# EAGLE design SineGenerator (EAGLE 6.4)
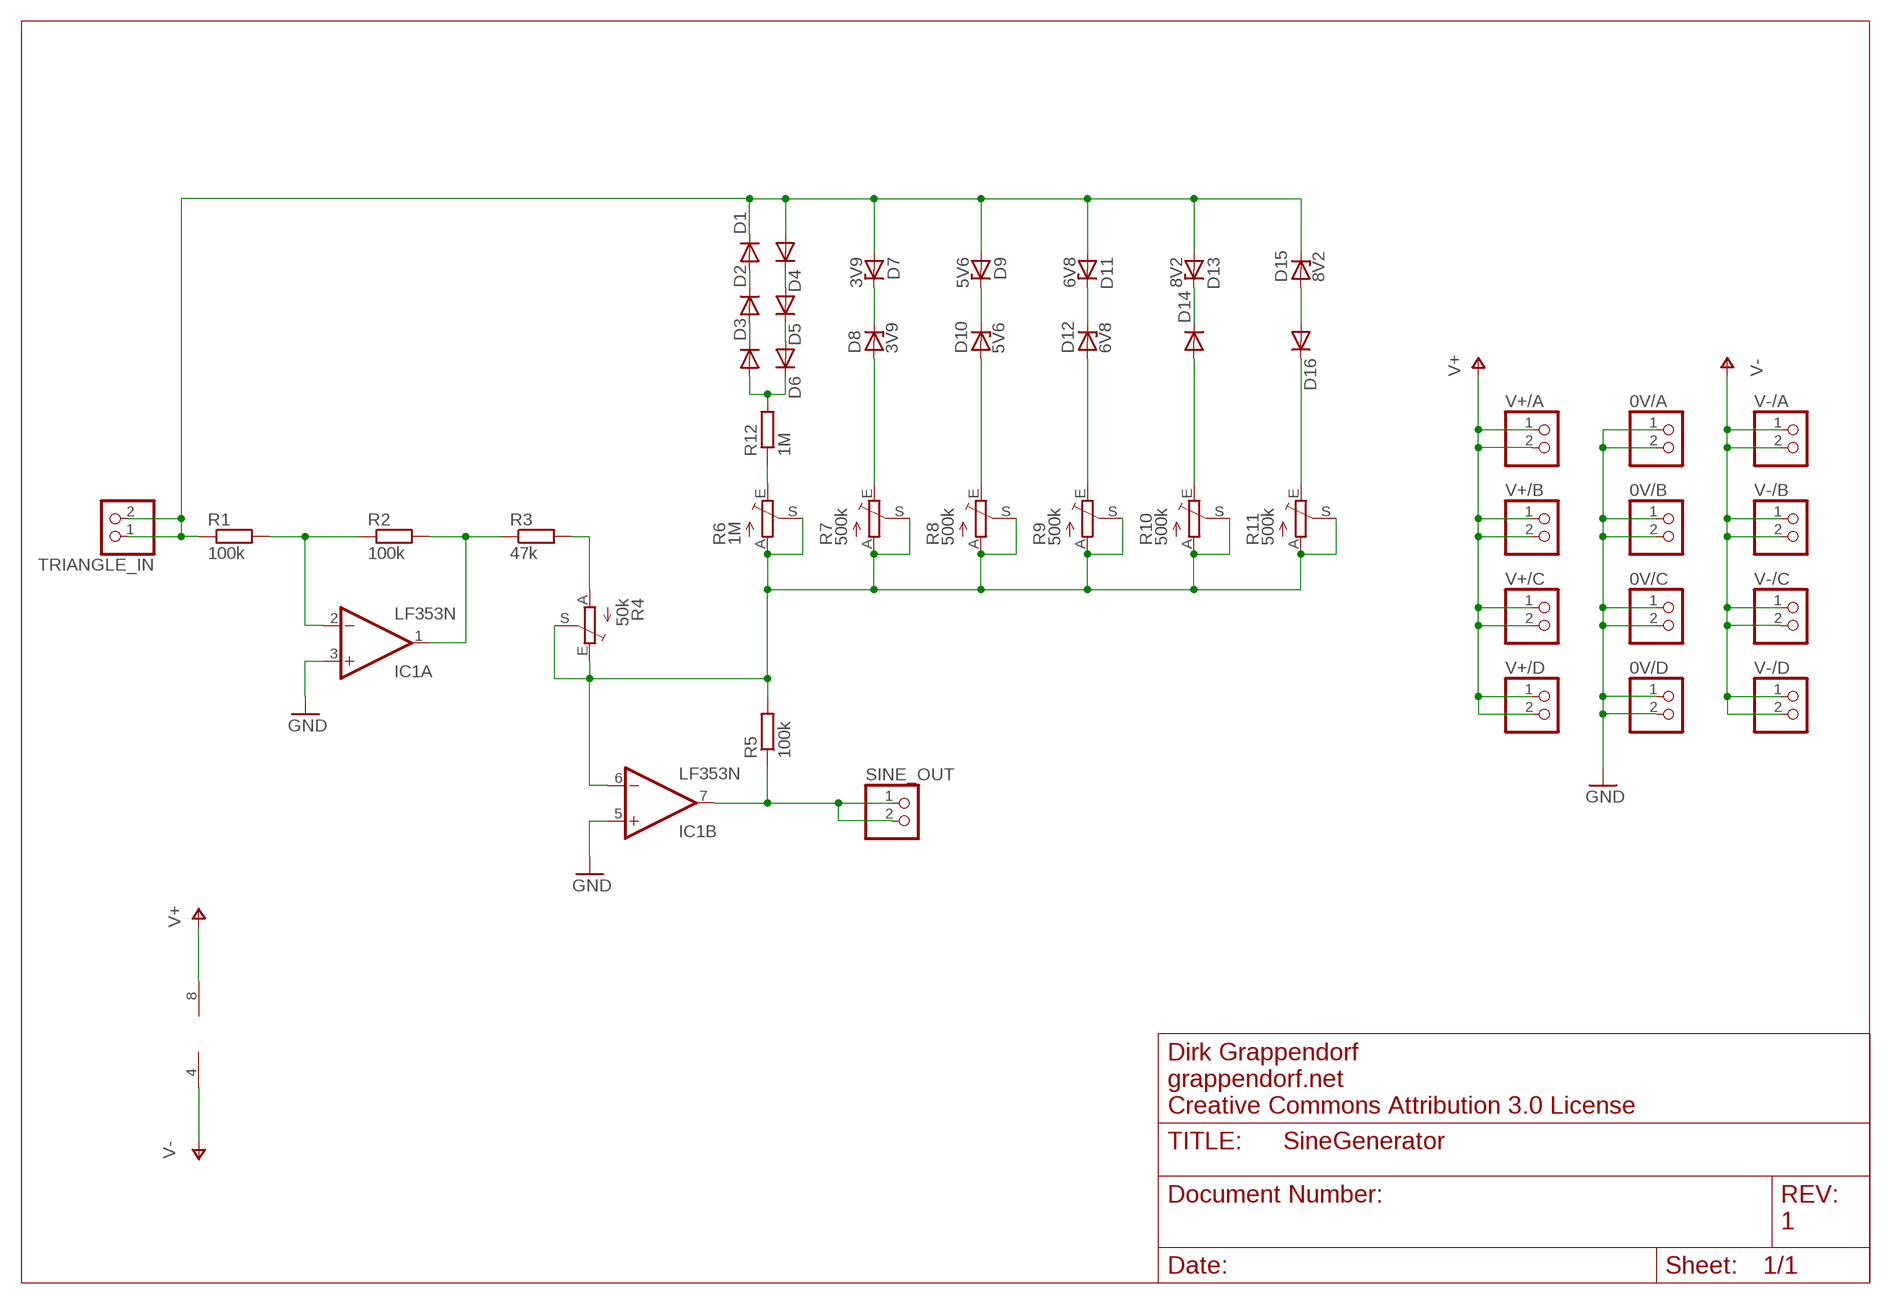
[diagram p0: schematic, sheet 1]

## Parts
0V/A  PINHD-1X2  [1X02]
0V/B  PINHD-1X2  [1X02]
0V/C  PINHD-1X2  [1X02]
0V/D  PINHD-1X2  [1X02]
D1  DIODE1N4148  [DIODE-1N4148]
D2  DIODE1N4148  [DIODE-1N4148]
D3  DIODE1N4148  [DIODE-1N4148]
D4  DIODE1N4148  [DIODE-1N4148]
D5  DIODE1N4148  [DIODE-1N4148]
D6  DIODE1N4148  [DIODE-1N4148]
D7  3V9  ZENER-DIODEDO34-7  [DO34Z7]
D8  3V9  ZENER-DIODEDO34-7  [DO34Z7]
D9  5V6  ZENER-DIODEDO34-7  [DO34Z7]
D10  5V6  ZENER-DIODEDO34-7  [DO34Z7]
D11  6V8  ZENER-DIODEDO34-7  [DO34Z7]
D12  6V8  ZENER-DIODEDO34-7  [DO34Z7]
D13  8V2  ZENER-DIODEDO34-7  [DO34Z7]
D14  DIODE1N4148  [DIODE-1N4148]
D15  8V2  ZENER-DIODEDO34-7  [DO34Z7]
D16  DIODE1N4148  [DIODE-1N4148]
IC1  LF353N  [DIL08]
R1  100k  R-EU_0207/7  [0207/7]
R2  100k  R-EU_0207/7  [0207/7]
R3  47k  R-EU_0207/7  [0207/7]
R4  50k  TRIM_EU-LI15  [LI15]
R5  100k  R-EU_0207/7  [0207/7]
R6  1M  TRIM_EU-ST15  [ST15]
R7  500k  TRIM_EU-ST15  [ST15]
R8  500k  TRIM_EU-ST15  [ST15]
R9  500k  TRIM_EU-ST15  [ST15]
R10  500k  TRIM_EU-ST15  [ST15]
R11  500k  TRIM_EU-ST15  [ST15]
R12  1M  R-EU_0207/7  [0207/7]
SINE_OUT  PINHD-1X2  [1X02]
TRIANGLE_IN  PINHD-1X2  [1X02]
V+/A  PINHD-1X2  [1X02]
V+/B  PINHD-1X2  [1X02]
V+/C  PINHD-1X2  [1X02]
V+/D  PINHD-1X2  [1X02]
V-/A  PINHD-1X2  [1X02]
V-/B  PINHD-1X2  [1X02]
V-/C  PINHD-1X2  [1X02]
V-/D  PINHD-1X2  [1X02]

## Nets
GND: 0V/A.1 0V/A.2 0V/B.1 0V/B.2 0V/C.1 0V/C.2 0V/D.1 0V/D.2 IC1.3(A:+IN) IC1.5(B:+IN)
N$1: IC1.2(A:-IN) R1.2 R2.1
N$2: D9.C D10.C
N$3: IC1.1(A:OUT) R2.2 R3.1
N$4: D10.A R8.E
N$6: R3.2 R4.A
N$7: D11.C D12.C
N$8: IC1.6(B:-IN) R4.E R4.S R5.2 R6.A R6.S R7.A R7.S R8.A R8.S R9.A R9.S R10.A R10.S R11.A R11.S
N$10: IC1.7(B:OUT) R5.1 SINE_OUT.1 SINE_OUT.2
N$16: D1.C D4.A D7.A D9.A D11.A D13.A D15.C R1.1 TRIANGLE_IN.1 TRIANGLE_IN.2
N$17: D1.A D2.C
N$18: D2.A D3.C
N$19: D3.A D6.C R12.2
N$20: D5.C D6.A
N$21: D4.C D5.A
N$22: R6.E R12.1
N$23: D7.C D8.C
N$24: D8.A R7.E
N$25: D12.A R9.E
N$26: D13.C D14.C
N$27: D14.A R10.E
N$28: D15.A D16.A
N$29: D16.C R11.E
V+: IC1.8(P:V+) V+/A.1 V+/A.2 V+/B.1 V+/B.2 V+/C.1 V+/C.2 V+/D.1 V+/D.2
V-: IC1.4(P:V-) V-/A.1 V-/A.2 V-/B.1 V-/B.2 V-/C.1 V-/C.2 V-/D.1 V-/D.2

## Notes on the sheet
- Dirk Grappendorf
- grappendorf.net
- Creative Commons Attribution 3.0 License
- 1

## Library data of the parts
0V/A 0V/B 0V/C 0V/D SINE_OUT TRIANGLE_IN V+/A V+/B V+/C V+/D V-/A V-/B V-/C V-/D = pinhead:PINHD-1X2: PIN HEADER
D1-D6 D14 D16 = SparkFun:DIODE: Diode These are standard reverse protection diodes and small signal diodes. SMA package can handle up to about 1A. SOD-323 can handle about 200mA. What the SOD-323 package when ordering, there are some mfgs out there that are 5-pin packages.
D7-D13 D15 = diode:ZENER-DIODE: Z-Diode
IC1 = linear:LF353: OP AMP
R1-R3 R5 R12 = rcl:R-EU_: RESISTOR, European symbol
R4 R6-R11 = pot:TRIM_EU-: POTENTIOMETER

## Board
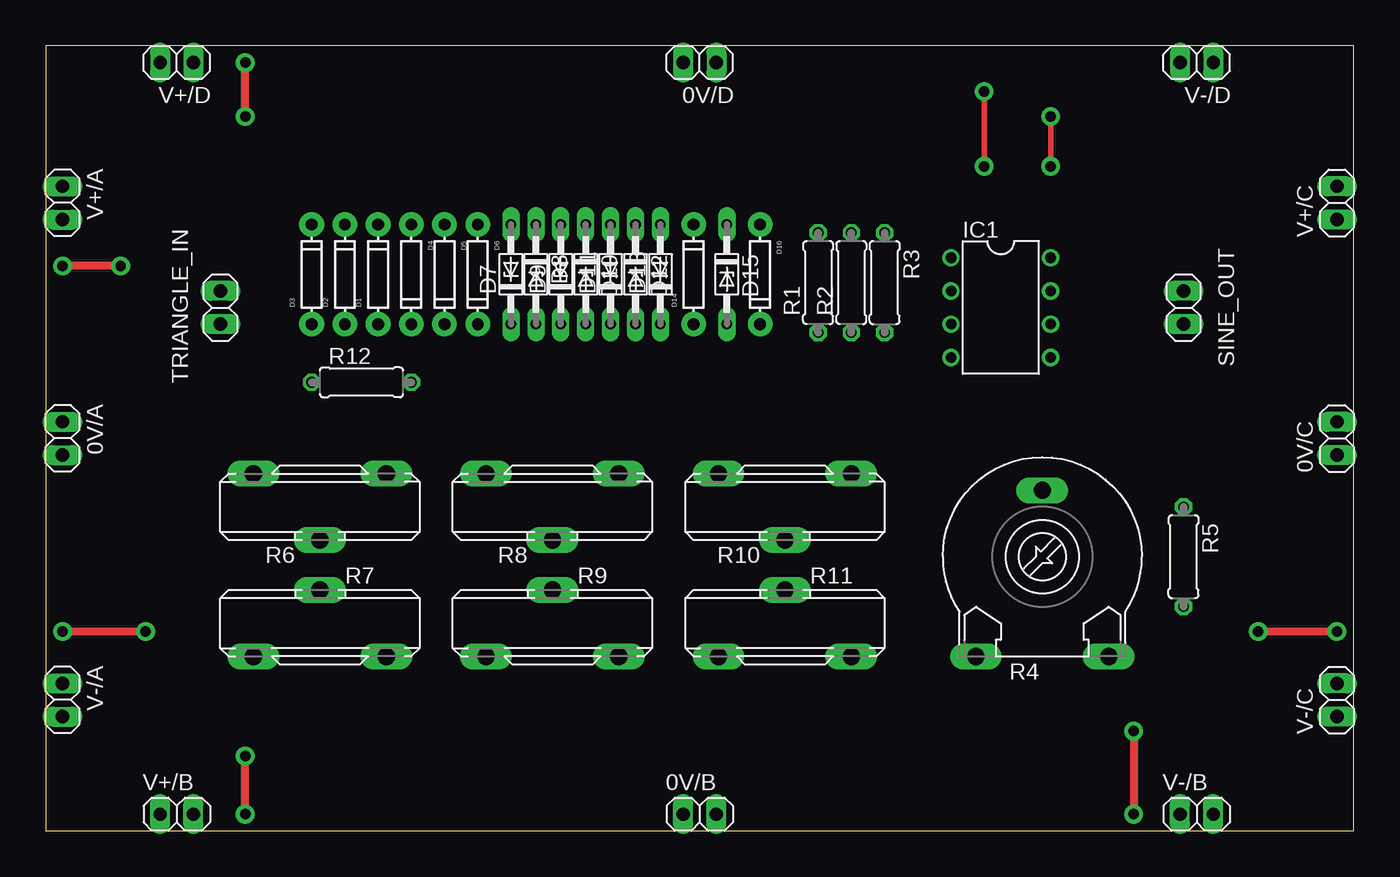
[diagram p1: board, top side]
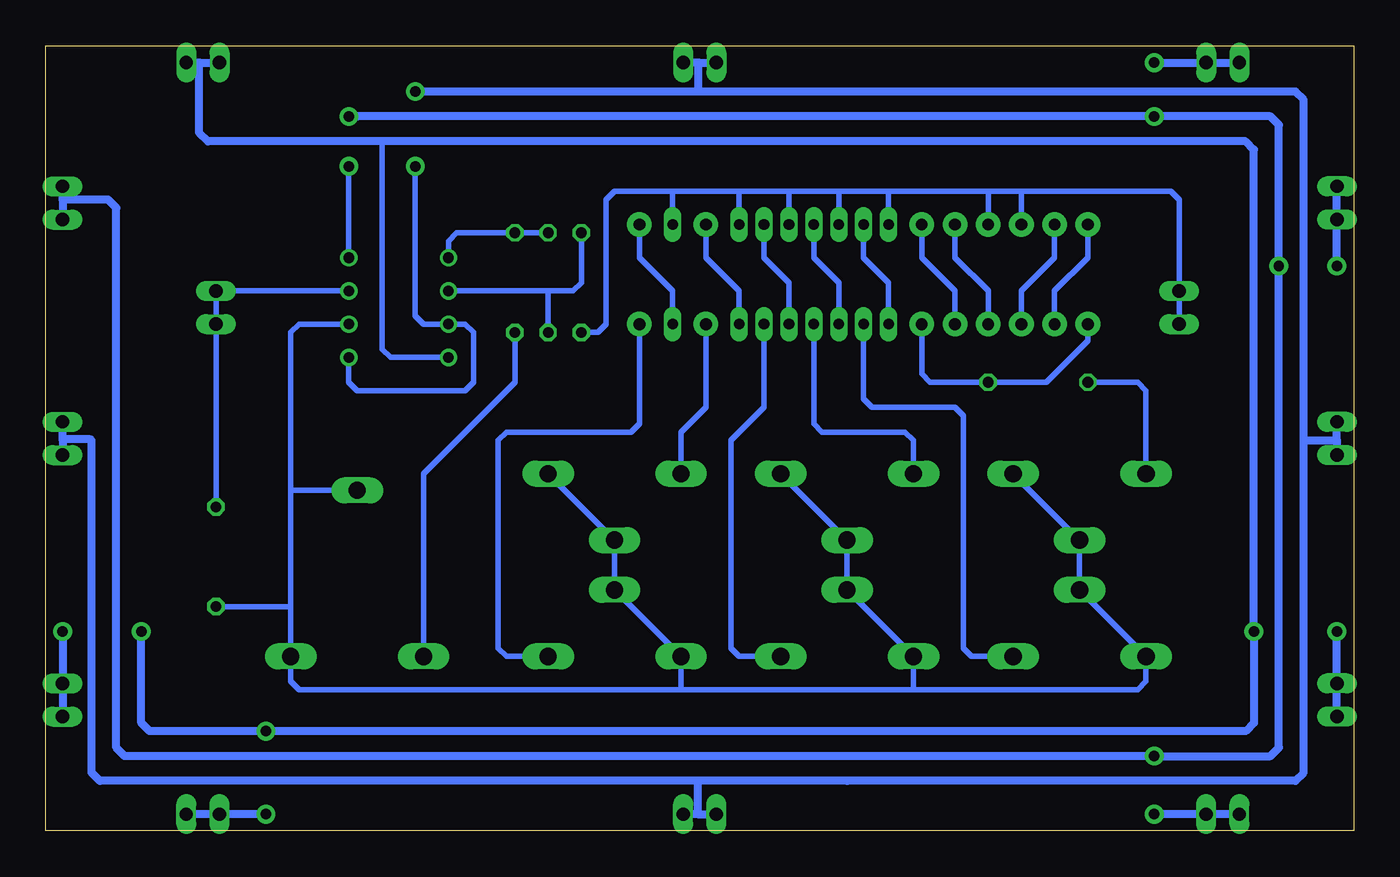
[diagram p2: board, bottom side, seen from below]

Size 100 x 60 mm. Coordinates in mm from the lower left corner, seen from the top.
Outline: 0,0 100,0 100,60 0,60 0,0
Copper layers (1*16): Top 0.035mm / dielectric 1.5mm / Bottom 0.035mm
Design rules "default *": minimum track width 10mil, minimum drill 24mil, track to track 8mil, track to pad 8mil, pad to pad 8mil, via to via 8mil, smd to smd 8mil, copper to edge 40mil, drill to drill 8mil, minimum pad ring 10mil, minimum via ring 8mil, stop-mask expansion 4mil, vias tented up to drill 0mil, thermal gap 10mil

### Footprints (pad centres in the part's own frame; a part is rotated, then mirrored left to right if it is on the bottom)
1X02 = drill 1.016 long: 1 -1.27,0; 2 1.27,0
DIODE-1N4148 = drill 0.9 pad 1.88: A -3.81,0; C 3.81,0
DO34Z7 = drill 0.813 long: A 3.81,0; C -3.81,0
DIL08 = drill 0.813 pad 1.27: 1 -3.81,-3.81; 2 -1.27,-3.81; 3 1.27,-3.81; 4 3.81,-3.81; 5 3.81,3.81; 6 1.27,3.81; 7 -1.27,3.81; 8 -3.81,3.81
0207/7 = drill 0.813 octagon: 1 -3.81,0; 2 3.81,0
LI15 = drill 1.321 long: A -5.08,-7.62; E 5.08,-7.62; S 0,5.08
ST15 = drill 1.321 long: A -5.08,-2.54; E 5.08,-2.54; S 0,2.54

### Placement (x,y rotation side)
0V/A  1.27,30 270 top
0V/B  50,1.27 0 top
0V/C  98.73,30 90 top
0V/D  50,58.73 180 top
D1  25.4,42.55 90 top
D2  22.86,42.55 90 top
D3  20.32,42.55 90 top
D4  27.94,42.55 270 top
D5  30.48,42.55 270 top
D6  33.02,42.55 270 top
D7  35.56,42.55 90 top
D8  37.47,42.55 270 top
D9  39.37,42.55 90 top
D10  41.27,42.55 270 top
D11  43.18,42.55 90 top
D12  45.09,42.55 270 top
D13  46.99,42.55 90 top
D14  49.53,42.55 90 top
D15  52.07,42.55 270 top
D16  54.61,42.55 270 top
IC1  73.03,40.01 270 top
R1  59.05,41.91 90 top
R2  61.59,41.91 90 top
R3  64.14,41.91 270 top
R4  76.2,20.95 0 top
R5  87,20.95 270 top
R6  20.95,24.77 180 top
R7  20.95,15.88 0 top
R8  38.73,24.77 180 top
R9  38.73,15.88 0 top
R10  56.52,24.77 180 top
R11  56.52,15.88 0 top
R12  24.13,34.29 0 top
SINE_OUT  87,40.01 90 top
TRIANGLE_IN  13.34,40.01 90 top
V+/A  1.27,48 270 top
V+/B  10,1.27 0 top
V+/C  98.73,48 90 top
V+/D  10,58.73 180 top
V-/A  1.27,10 270 top
V-/B  88,1.27 0 top
V-/C  98.73,10 90 top
V-/D  88,58.73 180 top

### Tracks (layer width: path | path; a pad name or v marks a point on that pad's centre or on a via)
GND  (via drill 0.8)
  Top 0.406: v71.75,56.52 v71.75,50.8
  Bottom 0.406: IC1.5 76.83,34.29 76.2,33.66 67.94,33.66 67.31,34.29 67.31,38.1 67.94,38.73 IC1.3 71.12,38.73 71.75,39.37 v71.75,50.8 | 71.12,56.52 v71.75,56.52
  Bottom 0.61: 1.27,29.84 0V/A.2 | 1.27,29.84 0V/A.1 | 50.08,58.73 0V/D.2 | 50.08,58.73 0V/D.1 | 98.73,29.93 0V/C.1 98.48,28.48 | 98.73,29.93 0V/C.2 | 50.16,1.27 0V/B.1 | 50.16,1.27 0V/B.2 | 3.81,29.84 3.81,5.08 3.81,4.45 4.45,3.81 38.73,3.81 50.16,3.81 | 3.81,29.84 3.81,55.88 4.45,56.52 50.16,56.52 | 50.16,3.81 95.89,3.81 96.52,4.45 96.52,29.84 96.6,29.93 98.73,29.93 | 50.16,56.52 71.12,56.52 v71.75,56.52 | 3.81,29.84 1.27,29.84 | 50.16,3.81 50.16,1.27 | 50.08,58.73 50.08,56.6 50.16,56.52
N$1
  Bottom 0.406: 61.59,41.27 59.69,41.27 59.05,41.91 R1.2 | 61.59,41.27 IC1.2 | R2.1 61.59,41.27
N$2
  Bottom 0.406: D10.C 41.27,43.81 39.37,41.91 D9.C
N$3
  Bottom 0.406: R2.2 R3.1 68.58,45.72 69.22,45.09 IC1.1
N$4
  Bottom 0.406: R8.E 33.66,29.84 34.29,30.48 40.64,30.48 41.27,31.11 D10.A
N$6
  Bottom 0.406: R3.2 64.14,34.29 71.12,27.3 R4.A
N$7
  Bottom 0.406: D12.C 45.09,43.81 43.18,41.91 D11.C
N$8
  Bottom 0.406: R6.A R6.S R7.S R7.A 15.88,11.43 16.51,10.79 33.66,10.79 | R8.A R8.S R9.S R9.A 33.66,10.79 | R10.A R10.S R11.S R11.A 51.44,10.79 | 33.66,10.79 51.44,10.79 | 51.44,10.79 80.64,10.79 81.28,11.43 R4.E 81.28,17.14 | 81.28,17.14 81.28,26.04 | 81.28,26.04 81.28,38.1 80.64,38.73 IC1.6 | 81.28,26.04 R4.S | 81.28,17.14 R5.2
N$10
  Bottom 0.406: IC1.7 SINE_OUT.2 SINE_OUT.1 R5.1
N$16
  Bottom 0.406: 25.4,48.9 13.97,48.9 13.34,48.26 TRIANGLE_IN.2 TRIANGLE_IN.1 | 25.4,48.9 27.94,48.9 | 27.94,48.9 35.56,48.9 | 35.56,48.9 39.37,48.9 | 39.37,48.9 43.18,48.9 | 43.18,48.9 46.99,48.9 | 46.99,48.9 50.16,48.9 52.07,48.9 | 46.99,48.9 D13.A | 43.18,48.9 D11.A | 39.37,48.9 D9.A | 35.56,48.9 D7.A | 27.94,48.9 D4.A | 25.4,48.9 D1.C | 52.07,48.9 56.52,48.9 57.15,48.26 57.15,38.73 57.78,38.1 R1.1 | 52.07,48.9 D15.C
N$17
  Bottom 0.406: D2.C 22.86,43.81 25.4,41.27 D1.A
N$18
  Bottom 0.406: D3.C 20.32,43.81 22.86,41.27 D2.A
N$19
  Bottom 0.406: D6.C 33.02,34.92 32.38,34.29 R12.2 23.5,34.29 20.32,37.47 D3.A
N$20
  Bottom 0.406: D6.A 33.02,43.81 30.48,41.27 D5.C
N$21
  Bottom 0.406: D5.A 30.48,43.81 27.94,41.27 D4.C
N$22
  Bottom 0.406: R6.E 15.88,33.66 16.51,34.29 R12.1
N$23
  Bottom 0.406: D8.C 37.47,43.81 35.56,41.91 D7.C
N$24
  Bottom 0.406: R7.E 29.21,13.34 29.84,13.97 29.84,31.75 30.48,32.38 36.83,32.38 37.47,33.02 D8.A
N$25
  Bottom 0.406: R9.E 46.99,13.34 47.62,13.97 47.62,29.84 45.09,32.38 D12.A
N$26
  Bottom 0.406: D14.C 49.53,43.81 46.99,41.27 D13.C
N$27
  Bottom 0.406: R10.E 51.44,30.48 49.53,32.38 D14.A
N$28
  Bottom 0.406: D16.A 54.61,43.81 52.07,41.27 D15.A
N$29
  Bottom 0.406: R11.E 64.77,13.34 65.41,13.97 65.41,29.84 64.77,30.48 55.24,30.48 54.61,31.11 D16.C
V+  (via drill 0.8)
  Top 0.406: v76.83,54.61 v76.83,50.8
  Top 0.61: v5.71,43.18 v1.27,43.18 | v15.24,1.27 v15.24,5.71 | v15.24,54.61 v15.24,58.73
  Bottom 0.406: v76.83,50.8 IC1.8 | 76.2,54.61 v76.83,54.61
  Bottom 0.61: v1.27,43.18 V+/A.2 V+/A.1 | V+/D.2 V+/D.1 14.91,58.73 v15.24,58.73 | 98.73,48.26 V+/C.1 | 98.73,48.26 V+/C.2 | V+/B.1 V+/B.2 15.05,1.27 v15.24,1.27 | v5.71,43.18 5.71,6.35 6.35,5.71 v15.24,5.71 20.32,5.71 61.59,5.71 93.98,5.71 94.61,6.35 94.61,47.62 95.25,48.26 98.73,48.26 | v5.71,43.18 5.71,43.72 | v76.83,54.61 76.2,54.61 v15.24,54.61 6.35,54.61 5.71,53.98 v5.71,43.18
V-  (via drill 0.8)
  Top 0.61: v1.27,15.24 v7.62,15.24 | v92.71,15.24 v98.73,15.24 | v83.19,7.62 v83.19,1.27
  Bottom 0.406: IC1.4 73.66,36.2 74.3,36.83 74.3,52.7
  Bottom 0.61: V-/A.2 V-/A.1 1.27,15.05 v1.27,15.24 | V-/C.1 V-/C.2 98.73,14.91 v98.73,15.24 | V-/B.2 V-/B.1 v83.19,1.27 | 88.27,58.73 V-/D.2 | 88.27,58.73 V-/D.1 | v92.71,15.24 92.71,8.26 92.08,7.62 v83.19,7.62 41.91,7.62 8.26,7.62 7.62,8.26 v7.62,15.24 7.62,52.07 8.26,52.7 74.3,52.7 87.63,52.7 88.27,53.34 88.27,58.73